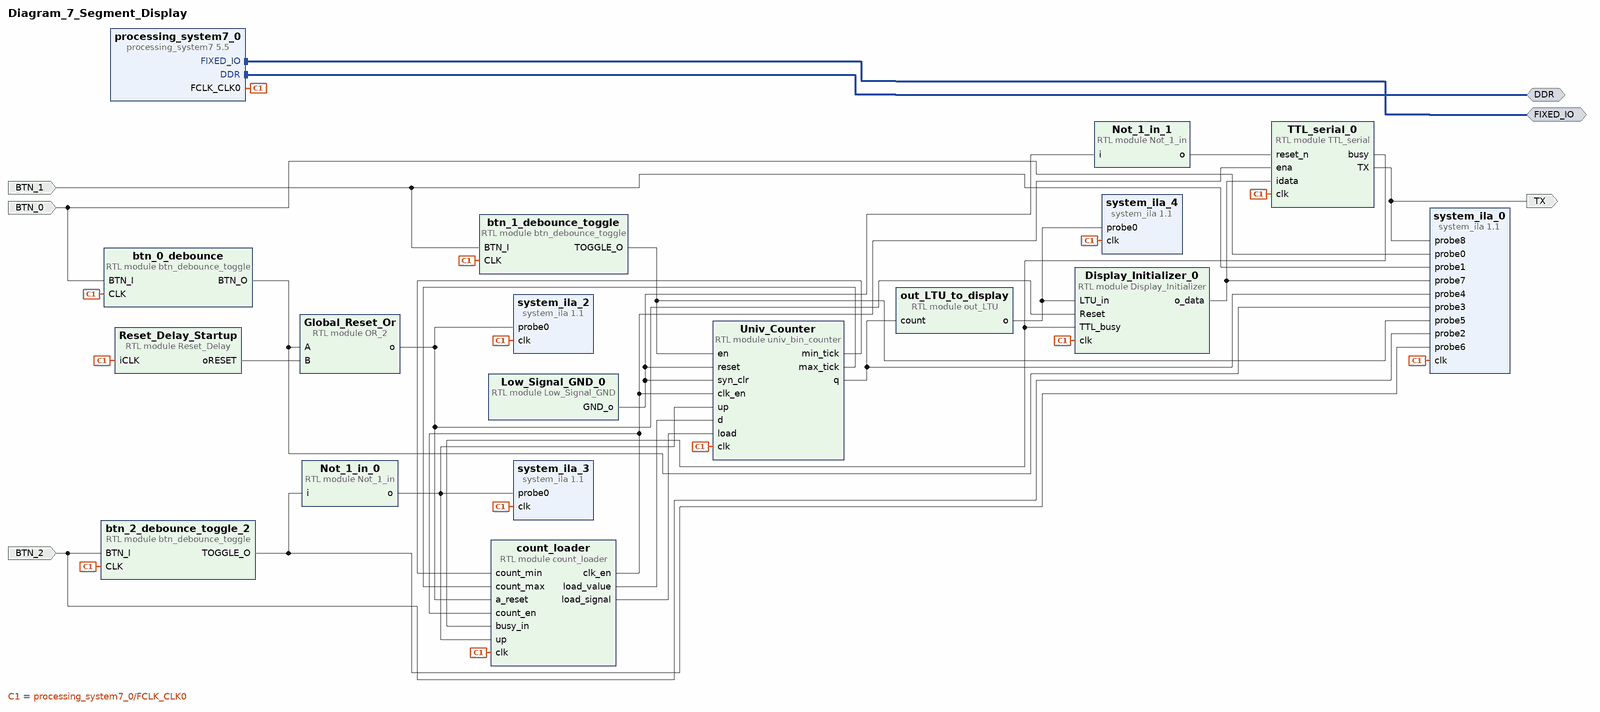
[diagram p0: block diagram of the top level]
# Vivado block design Diagram_7_Segment_Display, xc7z010clg225-3, Vivado 2019.1
create_bd_design Diagram_7_Segment_Display

create_bd_intf_port -mode Master -vlnv xilinx.com:interface:ddrx_rtl:1.0 DDR
create_bd_intf_port -mode Master -vlnv xilinx.com:display_processing_system7:fixedio_rtl:1.0 FIXED_IO
create_bd_port -dir I BTN_0
create_bd_port -dir I BTN_1
create_bd_port -dir I BTN_2
create_bd_port -dir O TX

create_bd_cell -type ip -vlnv xilinx.com:ip:processing_system7:5.5 processing_system7_0
set_property -dict [list \
  CONFIG.PCW_UART1_PERIPHERAL_ENABLE 1 \
  CONFIG.PCW_UART1_UART1_IO {MIO 8 .. 9} \
  CONFIG.PCW_UART_PERIPHERAL_FREQMHZ 100 \
  CONFIG.PCW_USE_M_AXI_GP0 0 \
] [get_bd_cells processing_system7_0]
# 42 more settings of processing_system7_0 are not shown: defaults, MIO pin electricals, DDR timing, and values the tool derives
create_bd_cell -type module -reference btn_debounce_toggle btn_0_debounce
create_bd_cell -type module -reference btn_debounce_toggle btn_1_debounce_toggle
create_bd_cell -type module -reference btn_debounce_toggle btn_2_debounce_toggle_2
create_bd_cell -type module -reference univ_bin_counter Univ_Counter
set_property -dict {CONFIG.N 8} [get_bd_cells Univ_Counter]
create_bd_cell -type module -reference Reset_Delay Reset_Delay_Startup
create_bd_cell -type module -reference OR_2 Global_Reset_Or
create_bd_cell -type module -reference count_loader count_loader
set_property -dict {CONFIG.d_size 8} [get_bd_cells count_loader]
create_bd_cell -type module -reference Not_1_in Not_1_in_0
create_bd_cell -type module -reference out_LTU out_LTU_to_display
set_property -dict {CONFIG.out_size 16} [get_bd_cells out_LTU_to_display]
create_bd_cell -type module -reference Not_1_in Not_1_in_1
create_bd_cell -type module -reference Low_Signal_GND Low_Signal_GND_0
create_bd_cell -type module -reference TTL_serial TTL_serial_0
set_property -dict {CONFIG.data_size 8} [get_bd_cells TTL_serial_0]
create_bd_cell -type ip -vlnv xilinx.com:ip:system_ila:1.1 system_ila_0
set_property -dict [list \
  CONFIG.C_MON_TYPE NATIVE \
  CONFIG.C_NUM_OF_PROBES 9 \
  CONFIG.C_PROBE0_TYPE 0 \
  CONFIG.C_PROBE1_TYPE 0 \
  CONFIG.C_PROBE2_TYPE 0 \
  CONFIG.C_PROBE3_TYPE 0 \
  CONFIG.C_PROBE4_TYPE 0 \
  CONFIG.C_PROBE5_TYPE 0 \
  CONFIG.C_PROBE6_TYPE 0 \
  CONFIG.C_PROBE7_TYPE 0 \
  CONFIG.C_PROBE8_TYPE 0 \
] [get_bd_cells system_ila_0]
create_bd_cell -type ip -vlnv xilinx.com:ip:system_ila:1.1 system_ila_2
set_property -dict {CONFIG.C_MON_TYPE NATIVE CONFIG.C_NUM_OF_PROBES 1 CONFIG.C_PROBE0_TYPE 0} [get_bd_cells system_ila_2]
create_bd_cell -type ip -vlnv xilinx.com:ip:system_ila:1.1 system_ila_3
set_property -dict {CONFIG.C_MON_TYPE NATIVE CONFIG.C_NUM_OF_PROBES 1 CONFIG.C_PROBE0_TYPE 0} [get_bd_cells system_ila_3]
create_bd_cell -type ip -vlnv xilinx.com:ip:system_ila:1.1 system_ila_4
set_property -dict {CONFIG.C_MON_TYPE NATIVE CONFIG.C_NUM_OF_PROBES 1 CONFIG.C_PROBE0_TYPE 0} [get_bd_cells system_ila_4]
create_bd_cell -type module -reference Display_Initializer Display_Initializer_0

# ---- connections ----

connect_bd_intf_net [get_bd_intf_ports FIXED_IO] [get_bd_intf_pins processing_system7_0/FIXED_IO]
connect_bd_intf_net [get_bd_intf_ports DDR] [get_bd_intf_pins processing_system7_0/DDR]
connect_bd_net -net BTN_0_input [get_bd_ports BTN_0] [get_bd_pins btn_0_debounce/BTN_I] [get_bd_pins system_ila_0/probe0]
connect_bd_net -net BTN_1_input [get_bd_ports BTN_1] [get_bd_pins btn_1_debounce_toggle/BTN_I] [get_bd_pins system_ila_0/probe1]
connect_bd_net -net BTN_2_input [get_bd_ports BTN_2] [get_bd_pins btn_2_debounce_toggle_2/BTN_I] [get_bd_pins system_ila_0/probe2]
connect_bd_net -net initializer_pre_debounce [get_bd_pins btn_0_debounce/BTN_O] [get_bd_pins Global_Reset_Or/A] [get_bd_pins system_ila_0/probe3]
connect_bd_net -net Clock_50 [get_bd_pins processing_system7_0/FCLK_CLK0] \
  [get_bd_pins btn_0_debounce/CLK] [get_bd_pins btn_1_debounce_toggle/CLK] [get_bd_pins btn_2_debounce_toggle_2/CLK] \
  [get_bd_pins Univ_Counter/clk] [get_bd_pins Reset_Delay_Startup/iCLK] [get_bd_pins count_loader/clk] \
  [get_bd_pins TTL_serial_0/clk] [get_bd_pins system_ila_0/clk] [get_bd_pins system_ila_2/clk] [get_bd_pins system_ila_4/clk] \
  [get_bd_pins system_ila_3/clk] [get_bd_pins Display_Initializer_0/clk]
connect_bd_net -net Counter_Value [get_bd_pins Univ_Counter/q] [get_bd_pins out_LTU_to_display/count] [get_bd_pins system_ila_0/probe4]
connect_bd_net -net univ_bin_counter_min_tick [get_bd_pins Univ_Counter/min_tick] [get_bd_pins count_loader/count_min]
connect_bd_net -net univ_bin_counter_max_tick [get_bd_pins Univ_Counter/max_tick] [get_bd_pins count_loader/count_max]
connect_bd_net -net count_loade_value [get_bd_pins count_loader/load_value] [get_bd_pins Univ_Counter/d]
connect_bd_net [get_bd_pins count_loader/load_signal] [get_bd_pins Univ_Counter/load]
connect_bd_net -net clock_en [get_bd_pins count_loader/clk_en] \
  [get_bd_pins Univ_Counter/clk_en] [get_bd_pins count_loader/count_en] [get_bd_pins TTL_serial_0/ena]
connect_bd_net -net Reset_Delay_o [get_bd_pins Reset_Delay_Startup/oRESET] [get_bd_pins Global_Reset_Or/B]
connect_bd_net -net Global_Reset [get_bd_pins Global_Reset_Or/o] \
  [get_bd_pins count_loader/a_reset] [get_bd_pins system_ila_2/probe0] [get_bd_pins Display_Initializer_0/Reset]
connect_bd_net -net debounce_direction_TOGGLE [get_bd_pins Not_1_in_0/o] \
  [get_bd_pins Univ_Counter/up] [get_bd_pins count_loader/up] [get_bd_pins system_ila_3/probe0]
connect_bd_net -net enable_toggle [get_bd_pins btn_1_debounce_toggle/TOGGLE_O] [get_bd_pins Univ_Counter/en] [get_bd_pins system_ila_0/probe5]
connect_bd_net -net btn_2_debounce_toggle_2_TOGGLE_O [get_bd_pins btn_2_debounce_toggle_2/TOGGLE_O] \
  [get_bd_pins Not_1_in_0/i] [get_bd_pins system_ila_0/probe6]
connect_bd_net -net Display_Initializer_data [get_bd_pins Display_Initializer_0/o_data] \
  [get_bd_pins TTL_serial_0/idata] [get_bd_pins system_ila_0/probe7]
connect_bd_net -net out_LTU [get_bd_pins out_LTU_to_display/o] [get_bd_pins system_ila_4/probe0] [get_bd_pins Display_Initializer_0/LTU_in]
connect_bd_net [get_bd_pins TTL_serial_0/busy] [get_bd_pins count_loader/busy_in] [get_bd_pins Display_Initializer_0/TTL_busy]
connect_bd_net -net TTL_serial_TX [get_bd_pins TTL_serial_0/TX] [get_bd_ports TX] [get_bd_pins system_ila_0/probe8]
connect_bd_net -net Low_Signal_GND_0_GND [get_bd_pins Low_Signal_GND_0/GND_o] \
  [get_bd_pins Univ_Counter/reset] [get_bd_pins Univ_Counter/syn_clr] [get_bd_pins Not_1_in_1/i]
connect_bd_net [get_bd_pins Not_1_in_1/o] [get_bd_pins TTL_serial_0/reset_n]
set_property HDL_ATTRIBUTE.DEBUG true [get_bd_nets BTN_0_input]
set_property HDL_ATTRIBUTE.MARK_DEBUG true [get_bd_nets BTN_0_input]
set_property HDL_ATTRIBUTE.DEBUG true [get_bd_nets BTN_1_input]
set_property HDL_ATTRIBUTE.MARK_DEBUG true [get_bd_nets BTN_1_input]
set_property HDL_ATTRIBUTE.DEBUG true [get_bd_nets BTN_2_input]
set_property HDL_ATTRIBUTE.MARK_DEBUG true [get_bd_nets BTN_2_input]
set_property HDL_ATTRIBUTE.DEBUG true [get_bd_nets initializer_pre_debounce]
set_property HDL_ATTRIBUTE.MARK_DEBUG true [get_bd_nets initializer_pre_debounce]
set_property HDL_ATTRIBUTE.DEBUG true [get_bd_nets Counter_Value]
set_property HDL_ATTRIBUTE.MARK_DEBUG true [get_bd_nets Counter_Value]
set_property HDL_ATTRIBUTE.DEBUG true [get_bd_nets Global_Reset]
set_property HDL_ATTRIBUTE.MARK_DEBUG true [get_bd_nets Global_Reset]
set_property HDL_ATTRIBUTE.DEBUG true [get_bd_nets debounce_direction_TOGGLE]
set_property HDL_ATTRIBUTE.MARK_DEBUG true [get_bd_nets debounce_direction_TOGGLE]
set_property HDL_ATTRIBUTE.DEBUG true [get_bd_nets enable_toggle]
set_property HDL_ATTRIBUTE.MARK_DEBUG true [get_bd_nets enable_toggle]
set_property HDL_ATTRIBUTE.DEBUG true [get_bd_nets btn_2_debounce_toggle_2_TOGGLE_O]
set_property HDL_ATTRIBUTE.MARK_DEBUG true [get_bd_nets btn_2_debounce_toggle_2_TOGGLE_O]
set_property HDL_ATTRIBUTE.DEBUG true [get_bd_nets Display_Initializer_data]
set_property HDL_ATTRIBUTE.MARK_DEBUG true [get_bd_nets Display_Initializer_data]
set_property HDL_ATTRIBUTE.DEBUG true [get_bd_nets out_LTU]
set_property HDL_ATTRIBUTE.MARK_DEBUG true [get_bd_nets out_LTU]
set_property HDL_ATTRIBUTE.DEBUG true [get_bd_nets TTL_serial_TX]
set_property HDL_ATTRIBUTE.MARK_DEBUG true [get_bd_nets TTL_serial_TX]

validate_bd_design
save_bd_design
